# EAGLE design SpringReverbBack (EAGLE 7.2.0)

## Sheet 1 of 2: Power
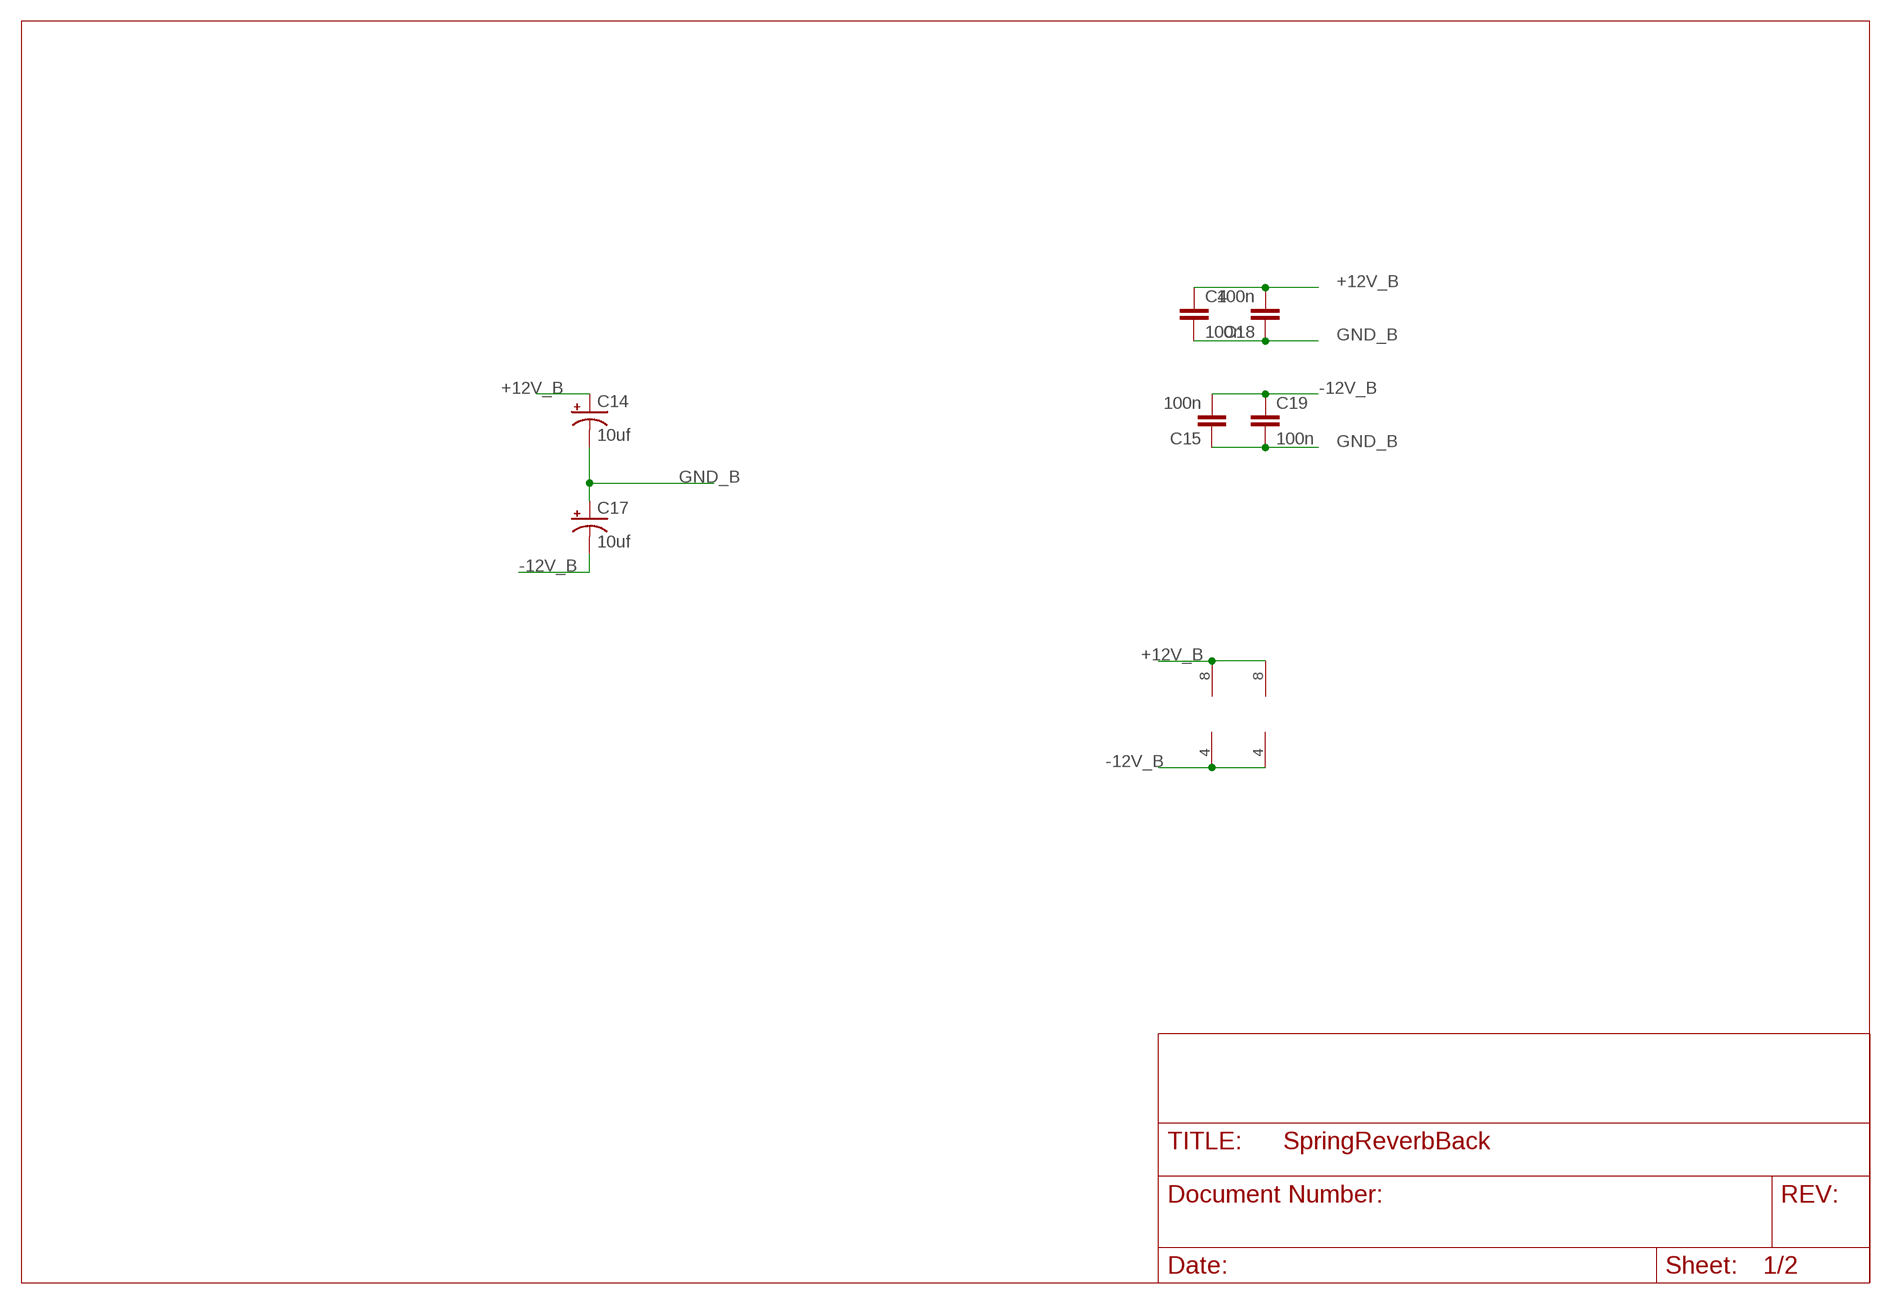
[diagram p0: schematic, sheet 1]

### Parts
BRICK  TL072  TL072P  [DIL08]
C4  100n  C-EU050-024X044  [C050-024X044]
C14  10uf  CAP_POLPTH2  [CPOL-RADIAL-10UF-25V]
C15  100n  C-EU050-024X044  [C050-024X044]
C17  10uf  CAP_POLPTH2  [CPOL-RADIAL-10UF-25V]
C18  100n  C-EU050-024X044  [C050-024X044]
C19  100n  C-EU050-024X044  [C050-024X044]
IC4_DRV_RCVR  TL072  TL072P  [DIL08]

### Nets
+12V_B [power]: BRICK.8(P:V+) C4.1 C14.1(+) C18.2 IC4_DRV_RCVR.8(P:V+) ; also sheet 2
-12V_B [power]: BRICK.4(P:V-) C15.2 C17.2(-) C19.1 IC4_DRV_RCVR.4(P:V-) ; also sheet 2
GND_B [ground]: C4.2 C14.2(-) C15.1 C17.1(+) C18.1 C19.2 ; also sheet 2

## Sheet 2 of 2
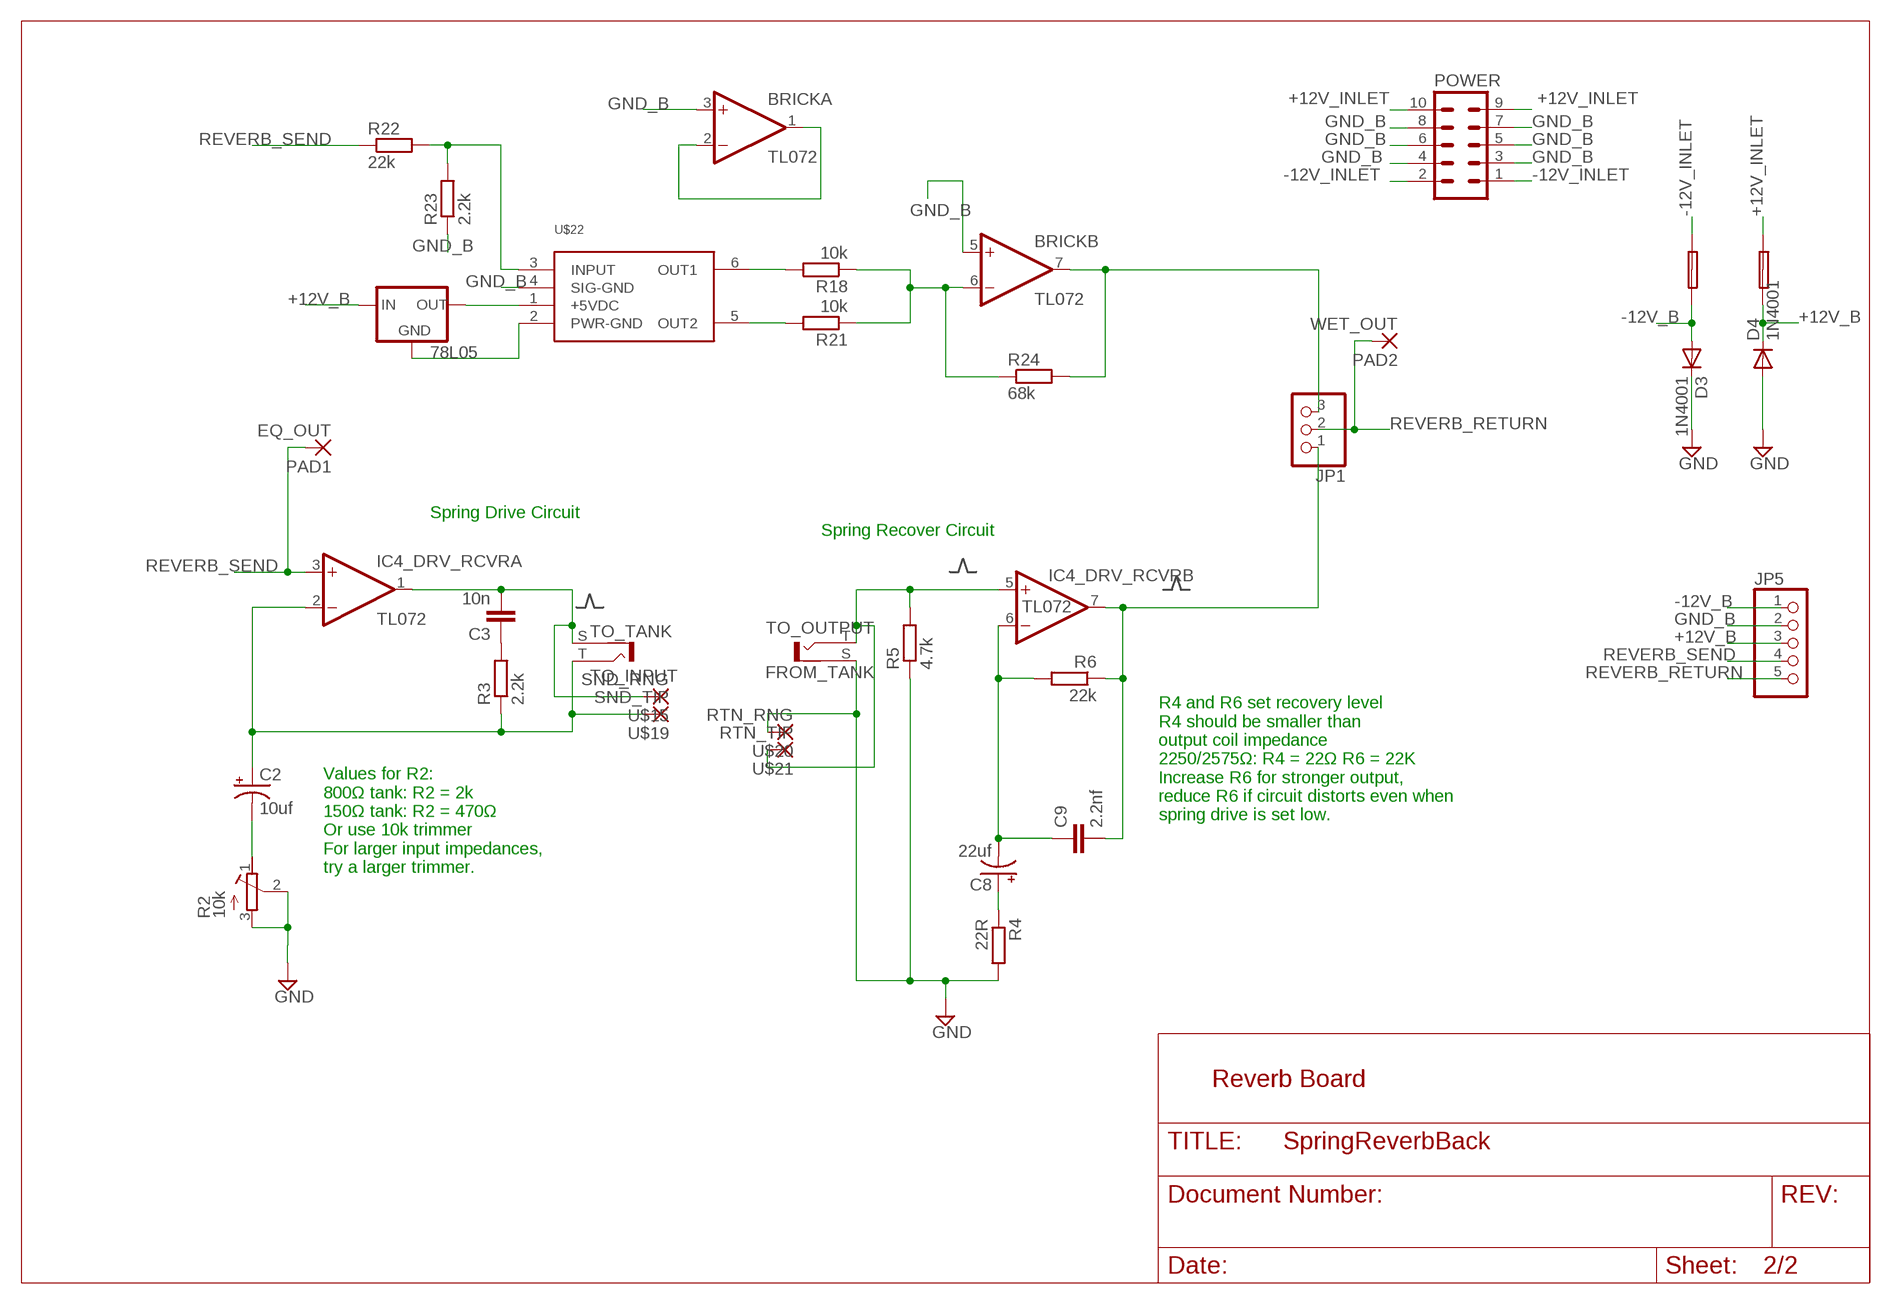
[diagram p1: schematic, sheet 2]

### Parts
0.1A_FUSE  FUSE  PTC_FUSEPOLY_FUSE  [C050H075X075]
0.1A_FUSE_2  FUSE  PTC_FUSEPOLY_FUSE  [C050H075X075]
78L05  V_REG_78XXTO-92  [TO-92]
C2  10uf  CAP_POLPTH2  [CPOL-RADIAL-10UF-25V]
C3  10n  C-EU050-024X044  [C050-024X044]
C8  22uf  CAP_POLPTH2  [CPOL-RADIAL-10UF-25V]
C9  2.2nf  C-EU050-024X044  [C050-024X044]
D3  1N4001  1N4004  [DO41-10]
D4  1N4001  1N4004  [DO41-10]
JP1  PINHD-1X3  [1X03]
JP5  PINHD-1X5  [1X05]
PAD1  EQ_OUT  LONG_PAD_1  [LONG_PAD_1]
PAD2  WET_OUT  LONG_PAD_1  [LONG_PAD_1]
POWER  10_PIN_HEADER  [MA05-2]
R2  10k  R-TRIMMT93YA  [RTRIMT93YA]
R3  2.2k  R-EU_STANDARD_RESISTOR  [0207/10]
R4  22R  R-EU_STANDARD_RESISTOR  [0207/10]
R5  4.7k  R-EU_STANDARD_RESISTOR  [0207/10]
R6  22k  R-EU_STANDARD_RESISTOR  [0207/10]
R18  10k  R-EU_STANDARD_RESISTOR  [0207/10]
R21  10k  R-EU_STANDARD_RESISTOR  [0207/10]
R22  22k  R-EU_STANDARD_RESISTOR  [0207/10]
R23  2.2k  R-EU_STANDARD_RESISTOR  [0207/10]
R24  68k  R-EU_STANDARD_RESISTOR  [0207/10]
TO_INPUT  TO_TANK  BTOR1  [BTOR1]
TO_OUTPUT  FROM_TANK  BTOR1  [BTOR1]
U$15  SND_RNG  LONG_PAD_1  [LONG_PAD_1]
U$19  SND_TIP  LONG_PAD_1  [LONG_PAD_1]
U$20  RTN_RNG  LONG_PAD_1  [LONG_PAD_1]
U$21  RTN_TIP  LONG_PAD_1  [LONG_PAD_1]
U$22  BTDR-2H  [BTDR-2H]

### Nets
+12V_B [power]: 0.1A_FUSE_2.1 78L05.3(IN) D4.C JP5.3 ; also sheet 1
+12V_INLET: 0.1A_FUSE_2.2 POWER.9 POWER.10
-12V_B [power]: 0.1A_FUSE.1 D3.A JP5.1 ; also sheet 1
-12V_INLET: 0.1A_FUSE.2 POWER.1 POWER.2
GND_B [ground]: BRICK.3(A:+IN) BRICK.5(B:+IN) D3.C D4.A JP5.2 POWER.3 POWER.4 POWER.5 POWER.6 POWER.7 POWER.8 R2.2(S) R2.3(E) R4.2 R5.1 R23.1 TO_OUTPUT.S U$20.P$1(P) U$22.4(SIG-GND) ; supply symbol labelled GND ; also sheet 1
N$1: C2.2(-) R2.1(A)
N$2: C3.1 R3.2
N$4: C3.2 IC4_DRV_RCVR.1(A:OUT) TO_INPUT.S U$15.P$1(P)
N$5: C2.1(+) IC4_DRV_RCVR.2(A:-IN) R3.1 TO_INPUT.T U$19.P$1(P)
N$7: IC4_DRV_RCVR.5(B:+IN) R5.2 TO_OUTPUT.T U$21.P$1(P)
N$8: C8.1(+) R4.1
N$9: C8.2(-) C9.1 IC4_DRV_RCVR.6(B:-IN) R6.2
N$19: 78L05.1(OUT) U$22.1(+5VDC)
N$27: R22.2 R23.2 U$22.3(INPUT)
N$28: R18.2 U$22.6(OUT1)
N$29: R21.2 U$22.5(OUT2)
N$30: BRICK.6(B:-IN) R18.1 R21.1 R24.1
N$32 [ground]: 78L05.2(GND) U$22.2(PWR-GND)
N$34: BRICK.1(A:OUT) BRICK.2(A:-IN)
N$38: BRICK.7(B:OUT) JP1.3 R24.2
N$39: C9.2 IC4_DRV_RCVR.7(B:OUT) JP1.1 R6.1
REVERB_RETURN: JP1.2 JP5.5 PAD2.P$1(P)
REVERB_SEND: IC4_DRV_RCVR.3(A:+IN) JP5.4 PAD1.P$1(P) R22.1
Unconnected: TO_INPUT.S@1 TO_INPUT.S@2 TO_INPUT.S@3 TO_OUTPUT.S@1 TO_OUTPUT.S@2 TO_OUTPUT.S@3

### Notes on the sheet
- Spring Drive Circuit
- Spring Recover Circuit
- Values for R2:
  800Ω tank: R2 = 2k
  150Ω tank: R2 = 470Ω
  Or use 10k trimmer
  For larger input impedances, 
  try a larger trimmer.
- R4 and R6 set recovery level 
  R4 should be smaller than 
  output coil impedance
  2250/2575Ω: R4 = 22Ω R6 = 22K 
  Increase R6 for stronger output, 
  reduce R6 if circuit distorts even when 
  spring drive is set low.
- Reverb Board

## Library data of the parts
0.1A_FUSE 0.1A_FUSE_2 = TomW:PTC_FUSE
78L05 = SparkFun-PowerIC:V_REG_78XX: Voltage Regulator Standard 7805 5V regulator. IGO (Input Ground Output). Spark Fun Electronics SKU : COM-00107
BRICK IC4_DRV_RCVR = TomW:TL072: OP AMP
C2 C8 C14 C17 = SparkFun-Passives:CAP_POL: Capacitor Polarized These are standard SMD and PTH capacitors. Normally 10uF, 47uF, and 100uF in electrolytic and tantalum varieties. Always verify the external diameter of the through hole cap, it varies with capacity, voltage, and manufacturer. The EIA devices should be standard.
C3 C4 C9 C15 C18 C19 = TomW:C-EU: CAPACITOR, European symbol
D3 D4 = diode:1N4004: DIODE general purpose rectifier, 1 A
JP1 = pinhead:PINHD-1X3: PIN HEADER
JP5 = pinhead:PINHD-1X5: PIN HEADER
PAD1 PAD2 U$15 U$19-U$21 = TomW:LONG_PAD_1
POWER = TomW:10_PIN_HEADER: PIN HEADER; OC_FARNELL: unknown; OC_NEWARK: unknown
R2 = resistor:R-TRIMM: Trimm resistor
R3-R6 R18 R21-R24 = TomW:R-EU_: RESISTOR, European symbol
TO_INPUT TO_OUTPUT = con-lumberg:BTOR1: RCA connectors according to JEITA RC-5231 Cinch RCA-Einbaukupplung nach JEITA RC-5231, stehende Ausführung Source: http://www.lumberg.de/Produkte/PDFs/BTOR1.pdf; MPN: BTOR 1; OC_FARNELL: 1217030; OC_NEWARK: 96K7172
U$22 = Accutronics BTDR-2H:BTDR-2H: Accutronics BTDR-2H Information: http://www.accutronicsreverb.com/main/?skin=sub01_05_1.html

## Net classes
0 default: width 0.61 mm
1 power: width 0.914 mm
2 ground: width 0.914 mm

## Board
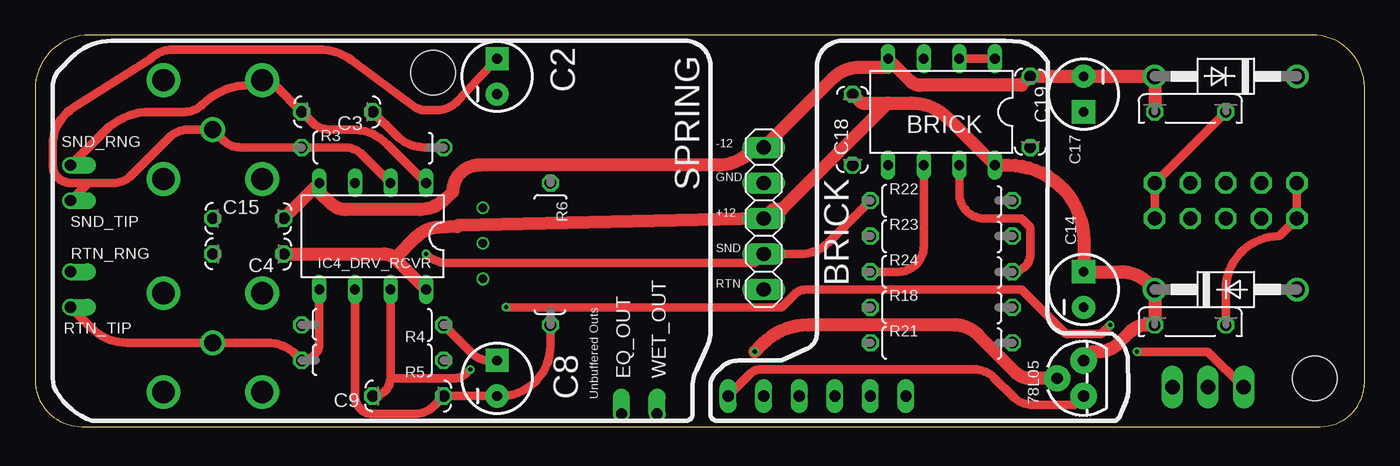
[diagram p2: board, top side]
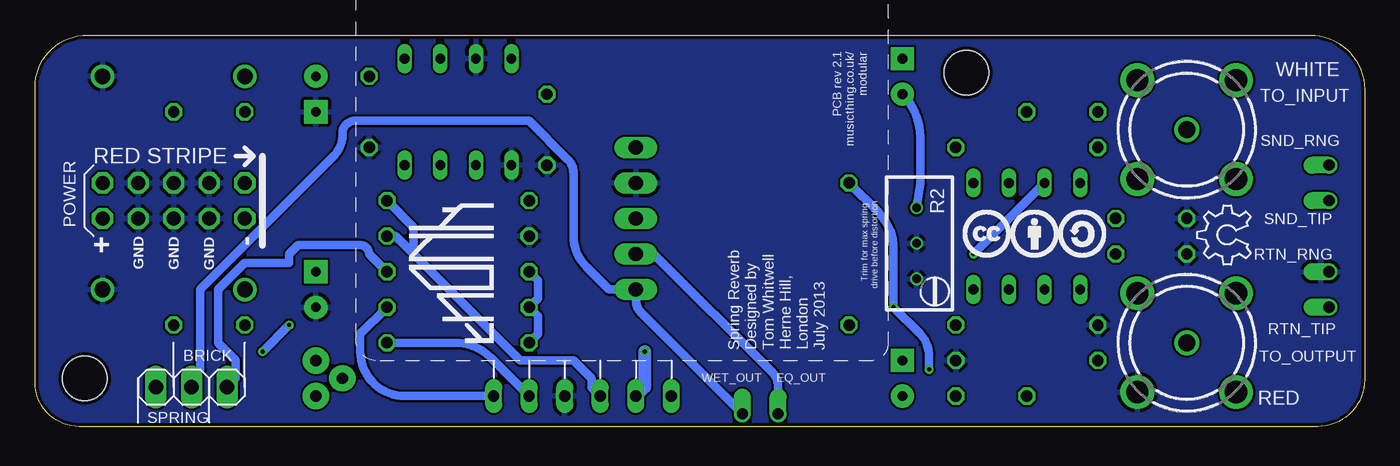
[diagram p3: board, bottom side, seen from below]

Size 95 x 28 mm. Coordinates in mm from the lower left corner, seen from the top.
Outline: 0,24.1 0,3.35 arc90 3.35,0 91.84,0 arc90 95,3.16 95,24.26 arc90 91.26,28 3.9,28 arc90 0,24.1
Copper layers (1*2*15*16): Top 0.035mm / dielectric 0.2mm / Route2 0.0175mm / dielectric 1.1mm / Route15 0.0175mm / dielectric 0.2mm / Bottom 0.035mm
Design rules "SeeedStudio_DRU_no_angle_20130527 *": minimum track width 6mil, minimum drill 12mil, track to track 6mil, track to pad 6mil, pad to pad 6mil, via to via 6mil, smd to smd 0mil, copper to edge 10mil, drill to drill 10mil, minimum pad ring 6mil, minimum via ring 6mil, stop-mask expansion 2mil, vias tented up to drill 25mil, thermal gap 10mil
Holes 3.2 mm at 28.45,25.29 91.44,3.45

### Footprints (pad centres in the part's own frame; a part is rotated, then mirrored left to right if it is on the bottom)
C050H075X075 = drill 0.813 octagon: 1 -2.54,0; 2 2.54,0
TO-92 = drill 0.813 pad 1.88: 1 -1.27,0; 2 0,1.905; 3 1.27,0
DIL08 = drill 0.7 long: 1 -3.81,-3.81; 2 -1.27,-3.81; 3 1.27,-3.81; 4 3.81,-3.81; 5 3.81,3.81; 6 1.27,3.81; 7 -1.27,3.81; 8 -3.81,3.81
CPOL-RADIAL-10UF-25V = drill 0.7 pad 1.651 square: 1 1.27,0 | drill 0.7 pad 1.651: 2 -1.27,0
C050-024X044 = drill 0.813 octagon: 1 -2.54,0; 2 2.54,0
DO41-10 = drill 1.118: A 5.08,0; C -5.08,0
1X03 = drill 1.016 long: 1 -2.54,0; 2 0,0; 3 2.54,0
1X05 = drill 1.016 long: 1 -5.08,0; 2 -2.54,0; 3 0,0; 4 2.54,0; 5 5.08,0
LONG_PAD_1 = drill 0.8 offset: P$1 0,0
MA05-2 = drill 1.016 octagon: 1 -5.08,-1.27; 2 -5.08,1.27; 3 -2.54,-1.27; 4 -2.54,1.27; 5 0,-1.27; 6 0,1.27; 7 2.54,-1.27; 8 2.54,1.27; 9 5.08,-1.27; 10 5.08,1.27
RTRIMT93YA = drill 0.61: 1 0,-2.54; 2 0,0; 3 0,2.54
0207/10 = drill 0.813 octagon: 1 -5.08,0; 2 5.08,0
BTOR1 = drill 1.6 pad 2.2: S -5,0; S@1 0,5; S@2 5,0; S@3 0,-5 | drill 1.2 pad 1.6: T 0,0
BTDR-2H = drill 0.8 long: 1 2.54,-17.78; 2 0,-17.78; 3 -2.54,-17.78; 4 -5.08,-17.78; 5 -7.62,-17.78; 6 -10.16,-17.78

### Placement (x,y rotation side)
0.1A_FUSE  82.55,22.5 0 top
0.1A_FUSE_2  82.55,7.26 0 top
78L05  74.93,3.45 90 top
BRICK  64.77,22.5 180 top
C2  33.02,25.04 90 top
C3  21.59,22.5 180 top
C4  15.24,12.34 180 top
C8  33.02,3.45 90 top
C9  26.67,2.18 180 top
C14  74.93,9.8 90 top
C15  15.24,14.88 0 top
C17  74.93,23.77 270 top
C18  58.42,21.23 90 top
C19  71.12,22.5 270 top
D3  85.09,25.04 180 top
D4  85.09,9.8 0 top
IC4_DRV_RCVR  24.13,13.61 180 top
JP1  83.82,2.81 0 bottom
JP5  52.07,14.88 270 top
PAD1  41.91,0.91 90 top
PAD2  44.45,0.91 90 top
POWER  85.09,16.15 180 bottom
R2  32,13.1 180 bottom
R3  24.13,19.96 0 top
R4  24.13,7.26 180 top
R5  24.13,4.72 180 top
R6  36.83,12.34 270 top
R18  64.77,8.53 0 top
R21  64.77,5.99 0 top
R22  64.77,16.15 0 top
R23  64.77,13.61 0 top
R24  64.77,11.07 0 top
TO_INPUT  12.7,21.23 315 bottom
TO_OUTPUT  12.7,5.99 45 bottom
U$1  [CC_1CM_SCREENPRINT]  28.7,12.09 0 bottom
U$2  [MTM_1CM_KEEPOUT]  40.89,15.39 90 bottom
U$3  [OSHW_6X150_NOTEXT]  8.13,11.58 90 bottom
U$4  [THONK_1CM_SCREENPRINT]  62.23,5.99 90 bottom
U$15  2.54,18.69 0 top
U$19  2.54,16.15 0 top
U$20  2.54,11.07 0 top
U$21  2.54,8.53 0 top
U$22  52.07,19.96 0 bottom

### Tracks (layer width: path | path; a pad name or v marks a point on that pad's centre or on a via)
+12V_B
  Top 0.914: 60.96,23.14 62.6,23.14 arc-45 65.22,22.05 BRICK.8 69.54,18.69 arc-90 74.93,13.3 C14.1 77.56,11.07 arc-45 79.57,10.24 D4.C 0.1A_FUSE_2.1 79.48,7.26 arc45 78.21,6.73 77.42,5.94 arc-45 76,5.35 75.56,5.35 78L05.3 | 60.96,23.14 59.05,23.14 C18.2 | 60.96,23.14 53.34,15.52 52.7,15.52 JP5.3 30.24,14.38 arc45 30.19,14.3 28.89,14.25 arc45 27.27,13.57 25.72,12.02 | C4.1 24.95,12.34 arc-45 25.72,12.02 | 25.72,12.02 IC4_DRV_RCVR.8
+12V_INLET
  Top 0.61: POWER.9 POWER.10 88.9,13.61 arc90 85.09,9.8 0.1A_FUSE_2.2
-12V_B
  Top 0.914: 0.1A_FUSE.1 D3.A C17.2 C19.1 70.48,24.41 63.24,24.41 arc-45 62.6,24.67 BRICK.4 60.96,25.68 58.9,25.68 arc45 57,24.89 JP5.1 51.44,19.96 51.09,19.62 arc-45 48.85,18.69 31.75,18.69 arc90 29.84,16.79 29.36,16.3 arc-45 27.46,15.52 22.18,15.52 arc-45 21.17,15.93 20.32,16.79 IC4_DRV_RCVR.4 C15.2
-12V_INLET
  Top 0.61: 0.1A_FUSE.2 POWER.1 POWER.2
GND_B
  pour Bottom: -2.54,-4.17 97.79,-1.63 97.79,31.39 -3.81,31.39
N$1
  Bottom 0.61: C2.2 arc45 31.75,20.7 31.75,17.42 R2.1
N$2
  Top 0.61: R3.2 27.85,19.96 arc-45 25.84,20.79 C3.1
N$4
  Top 0.61: IC4_DRV_RCVR.1 25.18,20.18 arc45 22.64,21.23 21.06,21.23 arc-45 19.79,21.76 C3.2 17.14,24.41 16.51,24.41 TO_INPUT.S 15.88,24.41 15.29,24.41 arc45 11.96,23.03 arc-45 10.69,22.5 8.25,22.5 arc45 5.01,21.16 U$15.P$1
N$5
  Top 0.61: IC4_DRV_RCVR.2 23.39,19.43 arc45 22.12,19.96 R3.1 14.71,19.96 arc-45 13.44,20.49 TO_INPUT.T 10.9,21.23 arc45 9.63,20.7 6.88,17.95 arc-45 5.61,17.42 3.81,17.42 | 3.81,17.42 U$19.P$1 | C2.1 30.19,23.27 arc-47 28.72,22.63 27.84,22.63 arc-36 27.1,22.87 22.61,26.19 arc36 20.32,26.95 9.84,26.95 arc45 8.22,26.27 2.74,22.8 arc58 1.27,20.12 1.27,18.69 arc90 2.54,17.42 3.81,17.42
  Bottom 0.61: IC4_DRV_RCVR.2 25.4,18.05
N$7
  Top 0.61: IC4_DRV_RCVR.5 20.32,5.99 arc-90 R5.2 18.61,5.16 arc45 16.6,5.99 TO_OUTPUT.T 6.57,5.99 arc-45 4.03,7.04 U$21.P$1
N$8
  Top 0.61: C8.1 32.49,4.72 arc-45 31.22,5.25 R4.1
N$9
  Top 0.61: IC4_DRV_RCVR.6 22.86,2.18 arc90 24.13,0.91 27.2,0.91 arc45 28.47,1.44 C9.1 C8.2 33.24,2.18 arc90 36.83,5.77 R6.2
N$19
  Top 0.61: U$22.1 51.17,3.82 arc-45 51.81,4.08 67.11,4.08 arc-45 68.53,3.5 69.9,2.13 arc45 71.32,1.54 74.3,1.54 78L05.1
N$27
  Bottom 0.61: U$22.3 55.24,2.81 55.24,3.45 56.52,4.72 60.33,4.72 67.94,12.34 | 67.94,12.34 69.22,13.61 R23.2 | R22.2 67.94,14.25 67.94,12.34
N$28
  Bottom 0.61: U$22.6 68.58,2.18 arc90 71.75,5.35 71.75,6.62 R18.2
N$29
  Bottom 0.61: R21.2 64.99,5.99 arc45 62.45,4.94 U$22.5
N$30
  Top 0.61: R24.1 61.7,11.07 arc90 63.5,12.87 BRICK.6
  Bottom 0.61: R21.1 59.05,6.62 59.05,7.9 R18.1 59.05,9.17 59.05,10.44 R24.1
N$32  (via drill 0.3)
  Top 0.914: v51.44,5.35 52,5.92 arc-45 55.24,7.26 65.73,7.26 arc-45 67.35,6.59 70.07,3.87 arc45 71.07,3.45 78L05.2
  Bottom 0.914: U$22.2 51.44,2.81 v51.44,5.35
N$34
  Top 0.61: BRICK.1 BRICK.2
N$38
  Top 0.61: BRICK.7 66.04,16.68 arc90 67.84,14.88 70.48,14.88 71.12,14.25 71.12,12.34 arc-90 R24.2
  Bottom 0.61: JP1.3 80.64,3.45 80.64,4.72 81.92,5.99 81.92,9.8 80.01,11.71 76.83,11.71 76.83,12.34 76.2,12.98 71.75,12.98 arc90 71.12,12.34 R24.2
N$39  (via drill 0.3)
  Top 0.61: C9.2 arc90 25.4,3.45 | 25.4,3.45 IC4_DRV_RCVR.7 | 25.4,3.45 29.95,3.45 arc45 30.85,3.82 v31.11,4.08 | JP1.1 83.82,5.35 v78.74,5.35 | v76.83,7.26 76.2,6.62 73.66,6.62 70.48,9.8 55.14,9.8 arc45 54.24,9.43 53.34,8.53 v33.66,8.53
  Bottom 0.61: R6.1 34.74,15.33 arc45 33.66,12.71 v33.66,8.53 31.79,6.66 arc45 31.11,5.04 v31.11,4.08 | v76.83,7.26 v78.74,5.35
REVERB_RETURN
  Bottom 0.61: JP1.2 83.82,3.45 83.19,4.08 83.19,9.8 73.7,19.29 arc-45 73.03,20.91 73.03,20.97 arc90 72.13,21.87 59.69,21.87 56.93,19.11 arc45 56.52,18.1 56.52,13.66 arc-45 55.59,11.41 53.98,9.8 JP5.5 52.07,9.06 arc-45 51.7,8.16 PAD2.P$1
REVERB_SEND  (via drill 0.3)
  Top 0.61: R22.1 56.71,13.17 arc-45 54.7,12.34 JP5.4 51.44,11.71 29.41,11.71 arc-45 27.99,12.29 v27.94,12.34
  Bottom 0.61: v27.94,12.34 IC4_DRV_RCVR.3 | PAD1.P$1 41.91,2.92 arc-45 42.28,3.82 50.8,12.34 JP5.4

### Text on the board
tPlace: -12 | GND | SPRING | +12 | SND | RTN | BRICK | Unbuffered Outs
bPlace: PCB rev 2.1 / musicthing.co.uk/ / modular | WHITE | Trim for max spring / drive before distortion | Spring Reverb / Designed by / Tom Whitwell / Herne Hill, / London / July 2013 | BRICK | RED | SPRING